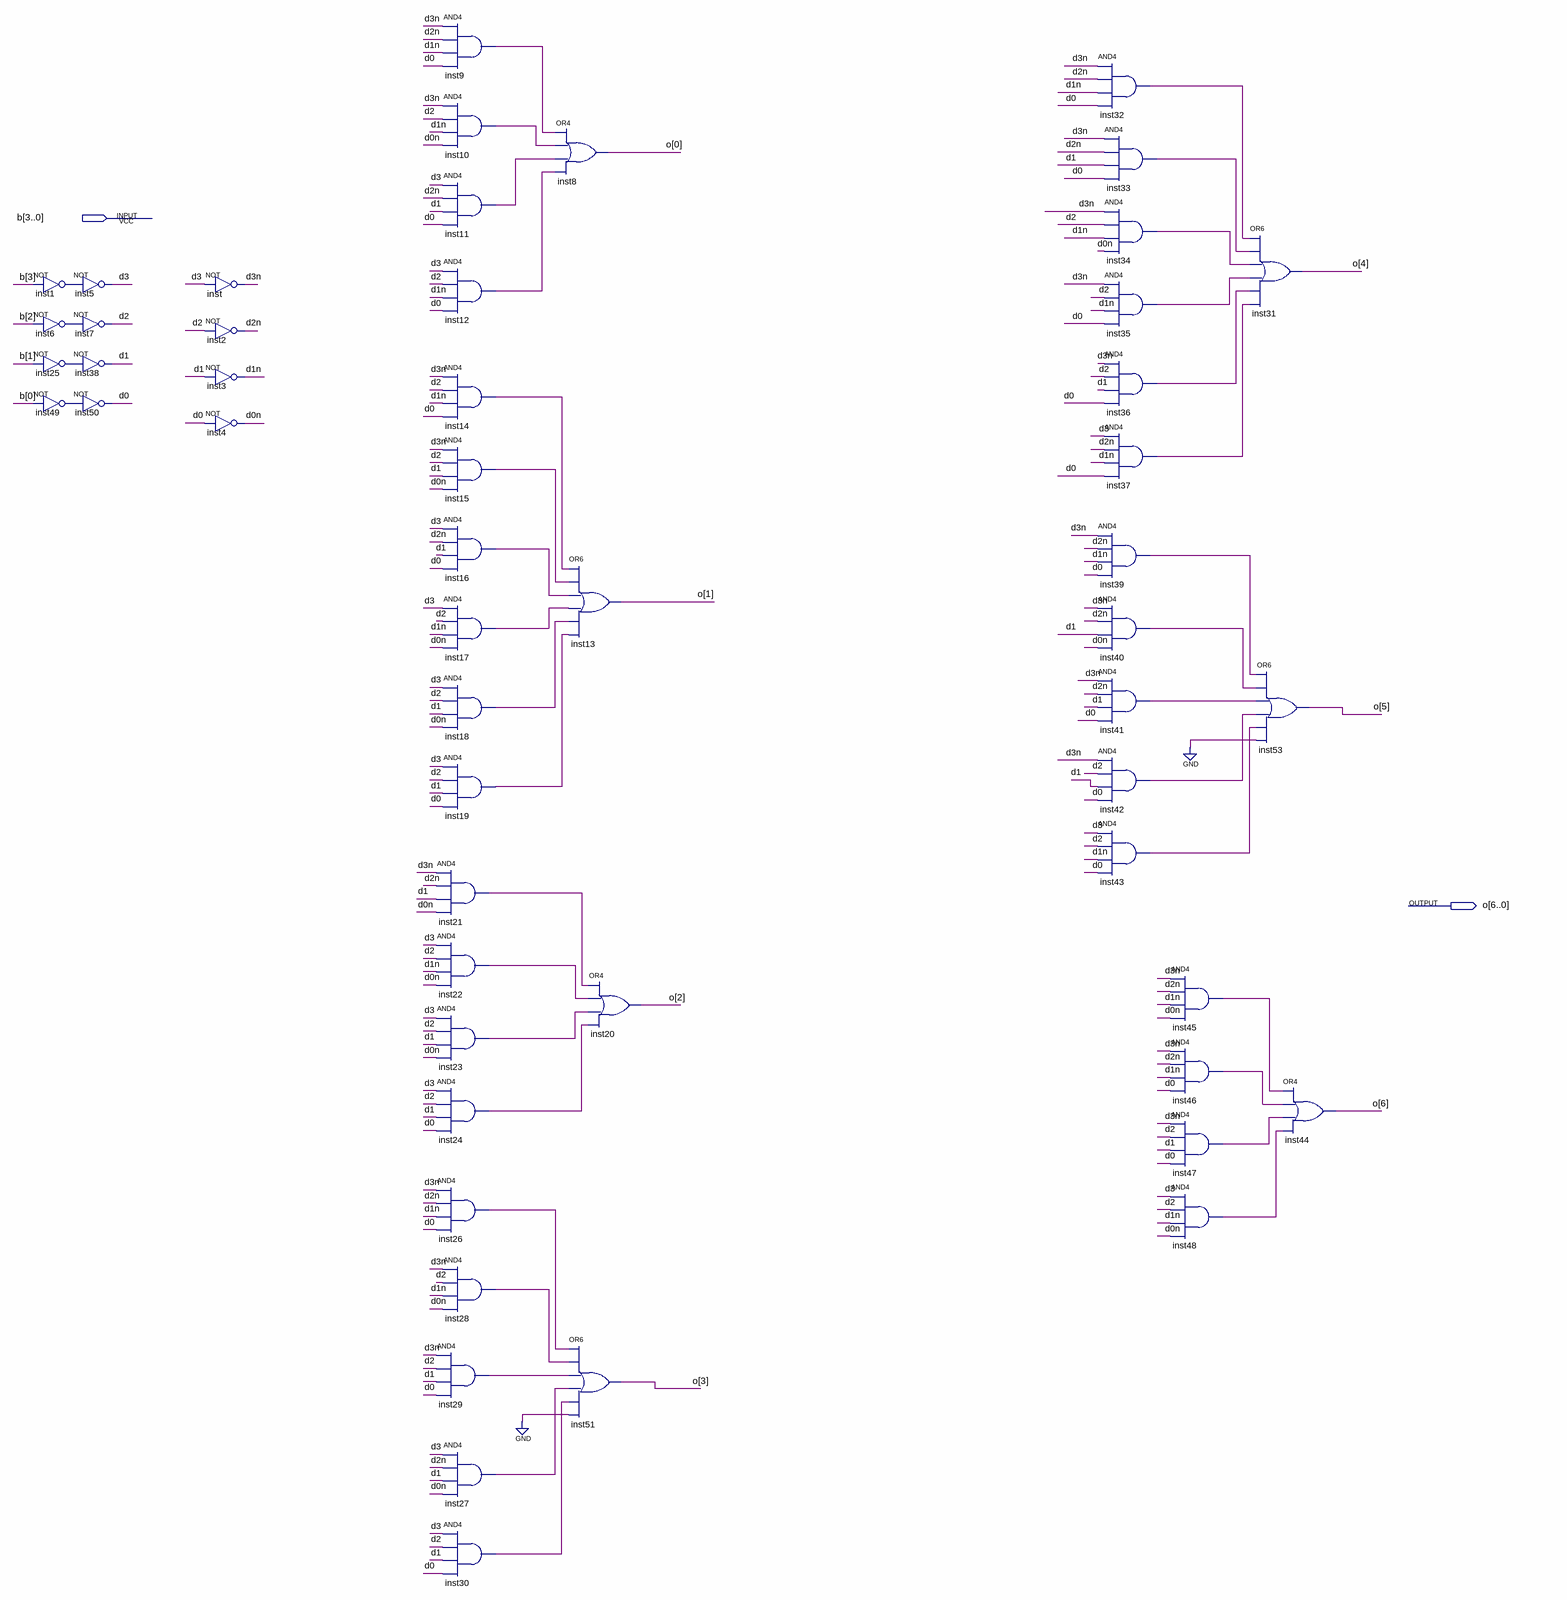
[diagram p0: schematic sheet]
// Quartus schematic display.bdf as structural Verilog: 53 symbols, 2 pins
module display (
  input  [3:0] b,
  output [6:0] o
);

  wire d0, d0n, d1, d1n, d2, d2n, d3, d3n, inst1_out, inst6_out, inst9_out, inst10_out, inst11_out,
       inst12_out, inst14_out, inst15_out, inst16_out, inst17_out, inst18_out, inst19_out, inst21_out,
       inst22_out, inst23_out, inst24_out, inst25_out, inst26_out, inst27_out, inst28_out, inst29_out,
       inst30_out, inst32_out, inst33_out, inst34_out, inst35_out, inst36_out, inst37_out, inst39_out,
       inst40_out, inst41_out, inst42_out, inst43_out, inst45_out, inst46_out, inst47_out, inst48_out,
       inst49_out;

  not inst1 (inst1_out, b[3]);
  not inst6 (inst6_out, b[2]);
  not inst25 (inst25_out, b[1]);
  not inst49 (inst49_out, b[0]);
  not inst5 (d3, inst1_out);
  not inst7 (d2, inst6_out);
  not inst38 (d1, inst25_out);
  not inst50 (d0, inst49_out);
  not inst (d3n, d3);
  not inst2 (d2n, d2);
  not inst3 (d1n, d1);
  not inst4 (d0n, d0);
  and inst9 (inst9_out, d3n, d2n, d1n, d0);
  and inst10 (inst10_out, d3n, d2, d1n, d0n);
  and inst11 (inst11_out, d3, d2n, d1, d0);
  and inst12 (inst12_out, d3, d2, d1n, d0);
  and inst14 (inst14_out, d3n, d2, d1n, d0);
  and inst15 (inst15_out, d3n, d2, d1, d0n);
  and inst16 (inst16_out, d3, d2n, d1, d0);
  and inst17 (inst17_out, d3, d2, d1n, d0n);
  and inst18 (inst18_out, d3, d2, d1, d0n);
  and inst19 (inst19_out, d3, d2, d1, d0);
  and inst21 (inst21_out, d3n, d2n, d1, d0n);
  and inst22 (inst22_out, d3, d2, d1n, d0n);
  and inst23 (inst23_out, d3, d2, d1, d0n);
  and inst24 (inst24_out, d3, d2, d1, d0);
  and inst26 (inst26_out, d3n, d2n, d1n, d0);
  and inst28 (inst28_out, d3n, d2, d1n, d0n);
  and inst29 (inst29_out, d3n, d2, d1, d0);
  and inst27 (inst27_out, d3, d2n, d1, d0n);
  and inst30 (inst30_out, d3, d2, d1, d0);
  or inst8 (o[0], inst9_out, inst10_out, inst11_out, inst12_out);
  or inst13 (o[1], inst14_out, inst15_out, inst16_out, inst17_out, inst18_out, inst19_out);
  or inst51 (o[3], inst26_out, inst28_out, inst29_out, inst27_out, inst30_out, 1'b0);
  or inst20 (o[2], inst21_out, inst22_out, inst23_out, inst24_out);
  and inst32 (inst32_out, d3n, d2n, d1n, d0);
  and inst33 (inst33_out, d3n, d2n, d1, d0);
  and inst34 (inst34_out, d3n, d2, d1n, d0n);
  and inst35 (inst35_out, d3n, d2, d1n, d0);
  and inst36 (inst36_out, d3n, d2, d1, d0);
  and inst37 (inst37_out, d3, d2n, d1n, d0);
  and inst39 (inst39_out, d3n, d2n, d1n, d0);
  and inst40 (inst40_out, d3n, d2n, d1, d0n);
  and inst41 (inst41_out, d3n, d2n, d1, d0);
  and inst42 (inst42_out, d3n, d2, d1, d0);
  and inst43 (inst43_out, d3, d2, d1n, d0);
  and inst45 (inst45_out, d3n, d2n, d1n, d0n);
  and inst46 (inst46_out, d3n, d2n, d1n, d0);
  and inst47 (inst47_out, d3n, d2, d1, d0);
  and inst48 (inst48_out, d3, d2, d1n, d0n);
  or inst31 (o[4], inst32_out, inst33_out, inst34_out, inst35_out, inst36_out, inst37_out);
  or inst53 (o[5], inst39_out, inst40_out, inst41_out, inst42_out, inst43_out, 1'b0);
  or inst44 (o[6], inst45_out, inst46_out, inst47_out, inst48_out);
endmodule
